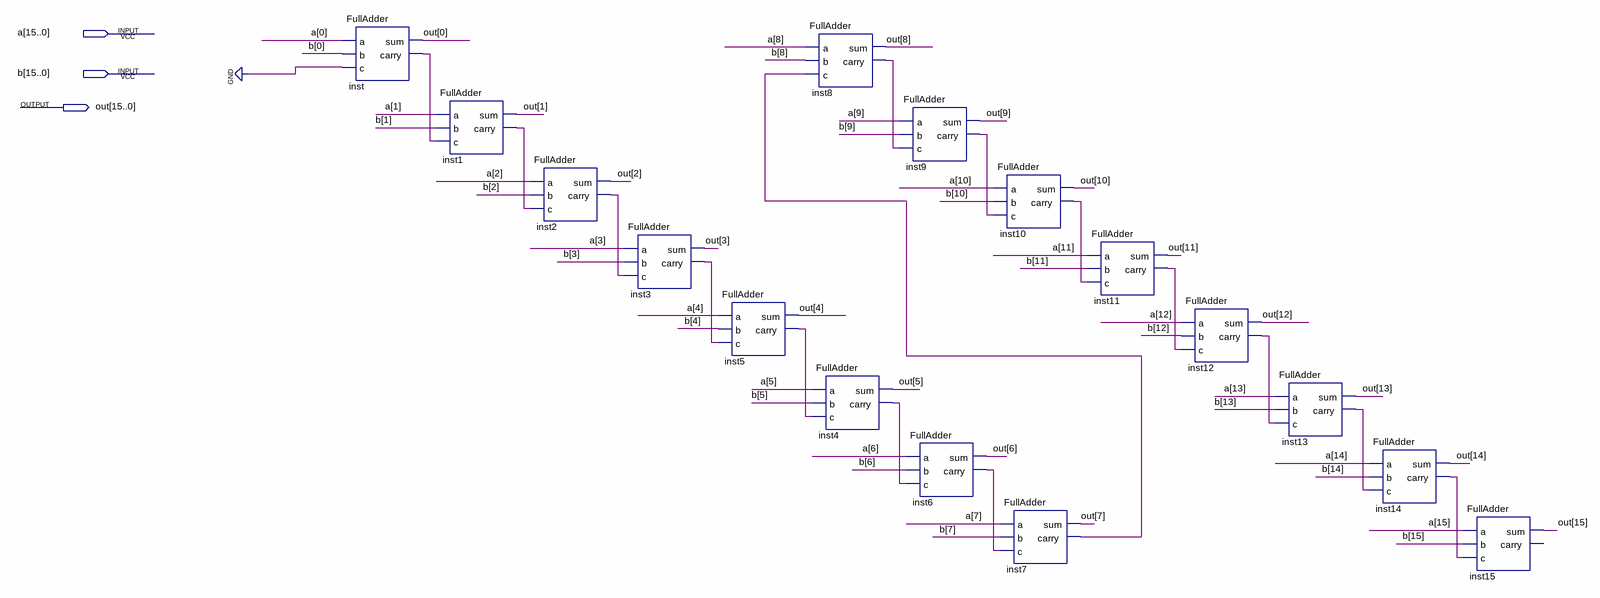
[diagram p0: schematic sheet]
// Quartus schematic Add16.bdf as structural Verilog: 16 symbols, 3 pins
module Add16 (
  input  [15:0] a,
  input  [15:0] b,
  output [15:0] out
);

  wire inst1_carry, inst2_carry, inst3_carry, inst4_carry, inst5_carry, inst6_carry, inst7_carry,
       inst8_carry, inst9_carry, inst10_carry, inst11_carry, inst12_carry, inst13_carry, inst14_carry,
       inst_carry;

  FullAdder inst (.a(a[0]), .b(b[0]), .c(1'b0), .sum(out[0]), .carry(inst_carry));
  FullAdder inst1 (.a(a[1]), .b(b[1]), .c(inst_carry), .sum(out[1]), .carry(inst1_carry));
  FullAdder inst2 (.a(a[2]), .b(b[2]), .c(inst1_carry), .sum(out[2]), .carry(inst2_carry));
  FullAdder inst3 (.a(a[3]), .b(b[3]), .c(inst2_carry), .sum(out[3]), .carry(inst3_carry));
  FullAdder inst5 (.a(a[4]), .b(b[4]), .c(inst3_carry), .sum(out[4]), .carry(inst5_carry));
  FullAdder inst8 (.a(a[8]), .b(b[8]), .c(inst7_carry), .sum(out[8]), .carry(inst8_carry));
  FullAdder inst4 (.a(a[5]), .b(b[5]), .c(inst5_carry), .sum(out[5]), .carry(inst4_carry));
  FullAdder inst9 (.a(a[9]), .b(b[9]), .c(inst8_carry), .sum(out[9]), .carry(inst9_carry));
  FullAdder inst6 (.a(a[6]), .b(b[6]), .c(inst4_carry), .sum(out[6]), .carry(inst6_carry));
  FullAdder inst10 (.a(a[10]), .b(b[10]), .c(inst9_carry), .sum(out[10]), .carry(inst10_carry));
  FullAdder inst7 (.a(a[7]), .b(b[7]), .c(inst6_carry), .sum(out[7]), .carry(inst7_carry));
  FullAdder inst11 (.a(a[11]), .b(b[11]), .c(inst10_carry), .sum(out[11]), .carry(inst11_carry));
  FullAdder inst12 (.a(a[12]), .b(b[12]), .c(inst11_carry), .sum(out[12]), .carry(inst12_carry));
  FullAdder inst13 (.a(a[13]), .b(b[13]), .c(inst12_carry), .sum(out[13]), .carry(inst13_carry));
  FullAdder inst14 (.a(a[14]), .b(b[14]), .c(inst13_carry), .sum(out[14]), .carry(inst14_carry));
  FullAdder inst15 (.a(a[15]), .b(b[15]), .c(inst14_carry), .sum(out[15]));  // open: carry
endmodule
